# Altium schematic sheet LVDS.SchDoc: Iris
size A3; Organization: Toradex AG; Address1: Altsagenstrasse 5; Address2: Horw; Address3: 6048; Address4: Switzerland; DocumentNumber: 12; Revision: V2.0; SheetNumber: 12; SheetTotal: 16
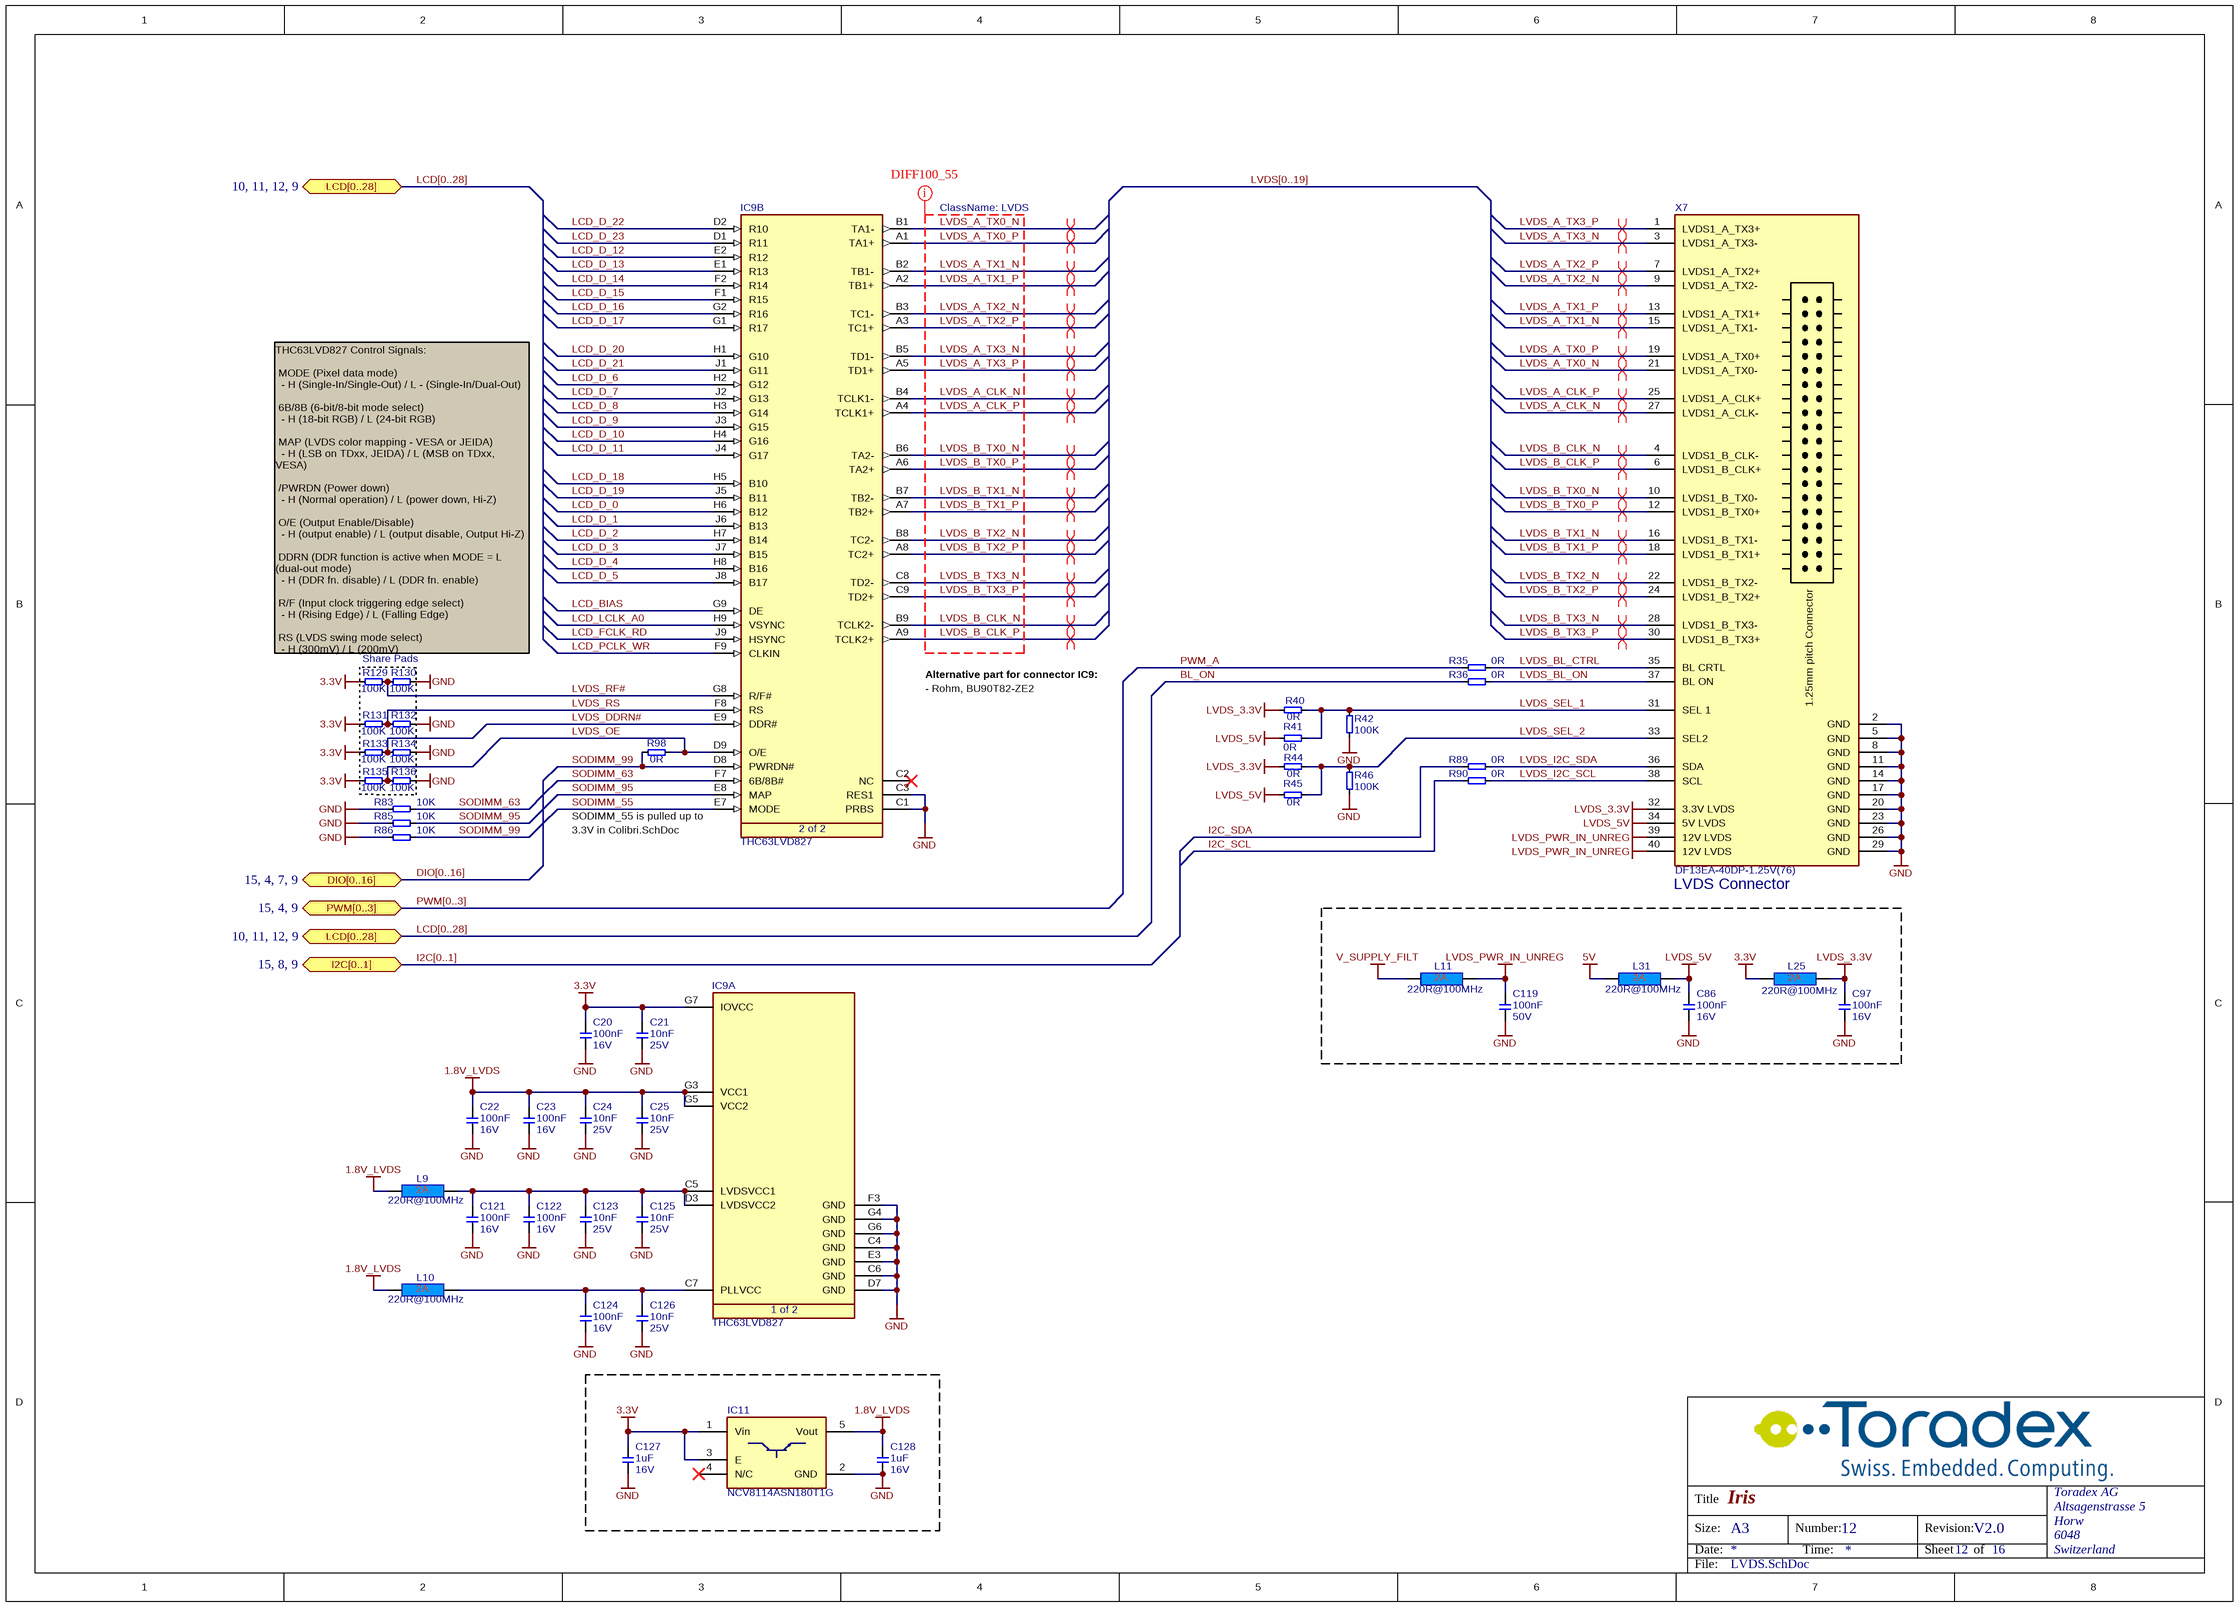
[diagram p0: LVDS.SchDoc]

## Parts
C20  Rating: 16V  [CAPC1005X60N]  (hidden comment: 100nF)
C21  Rating: 25V  [CAPC1005X60N]  (hidden comment: 10nF)
C22  Rating: 16V  [CAPC1005X60N]  (hidden comment: 100nF)
C23  Rating: 16V  [CAPC1005X60N]  (hidden comment: 100nF)
C24  Rating: 25V  [CAPC1005X60N]  (hidden comment: 10nF)
C25  Rating: 25V  [CAPC1005X60N]  (hidden comment: 10nF)
C86  Rating: 16V  [CAPC1005X60N]  (hidden comment: 100nF)
C97  Rating: 16V  [CAPC1005X60N]  (hidden comment: 100nF)
C119  Rating: 50V  [T_CAPC0603X33N]  (hidden comment: 100nF)
C121  Rating: 16V  [CAPC1005X60N]  (hidden comment: 100nF)
C122  Rating: 16V  [CAPC1005X60N]  (hidden comment: 100nF)
C123  Rating: 25V  [CAPC1005X60N]  (hidden comment: 10nF)
C124  Rating: 16V  [CAPC1005X60N]  (hidden comment: 100nF)
C125  Rating: 25V  [CAPC1005X60N]  (hidden comment: 10nF)
C126  Rating: 25V  [CAPC1005X60N]  (hidden comment: 10nF)
C127  Rating: 16V  [T_CAPC0603X33N]  (hidden comment: 1uF)
C128  Rating: 16V  [T_CAPC0603X33N]  (hidden comment: 1uF)
IC9  THC63LVD827  [BGA72C65P9X9_700X700X120]  (parts A,B of 2)
IC11  NCV8114ASN180T1G  [SOT95P279X142-5N]
L9  220R@100MHz  [INDC1608X95N]
L10  220R@100MHz  [INDC1608X95N]
L11  220R@100MHz  [INDC1608X95N]
L25  220R@100MHz  [INDC1608X95N]
L31  220R@100MHz  [INDC1608X95N]
R35  0R  [T_RESC0603X30N]
R36  0R  [T_RESC0603X30N]
R40  0R  [T_RESC0603X30N]
R41  0R  [T_RESC0603X30N]
R42  100K  [T_RESC0603X30N]
R44  0R  [T_RESC0603X30N]
R45  0R  [T_RESC0603X30N]
R46  100K  [T_RESC0603X30N]
R83  10K  [T_RESC0603X30N]
R85  10K  [T_RESC0603X30N]
R86  10K  [T_RESC0603X30N]
R89  0R  [T_RESC0603X30N]
R90  0R  [T_RESC0603X30N]
R98  0R  [T_RESC0603X30N]
R129  100K  [T_RESC0603X30N]
R130  100K  [T_RESC0603X30N]
R131  100K  [T_RESC0603X30N]
R132  100K  [T_RESC0603X30N]
R133  100K  [T_RESC0603X30N]
R134  100K  [T_RESC0603X30N]
R135  100K  [T_RESC0603X30N]
R136  100K  [T_RESC0603X30N]
X7  DF13EA-40DP-1.25V(76)  [T_HIROSE_DF13A-40DP-1.25V(55)]

## Blocks framed on the sheet
Share Pads: R129-R136
LVDS Connector: C86 C97 C119 L11 L25 L31

## Ports
DIO[0..16] (bidir, see 15, 4, 7, 9), I2C[0..1] (bidir, see 15, 8, 9), LCD[0..28] (bidir, see 10, 11, 12, 9), PWM[0..3] (bidir, see 15, 4, 9)

## Nets
1.8V_LVDS: C22.2 C23.2 C24.2 C25.2 C128.2 IC9.G3(VCC1) IC9.G5(VCC2) IC11.5(Vout) L9.1 L10.1
3.3V: C20.2 C21.2 C127.2 IC9.G7(IOVCC) IC11.1(Vin) IC11.3(E) L25.1 R129.1 R131.1 R133.1 R135.1
5V: L31.1
GND: C20.1 C21.1 C22.1 C23.1 C24.1 C25.1 C86.1 C97.1 C119.1 C121.1 C122.1 C123.1 C124.1 C125.1 C126.1 C127.1 C128.1 IC9.C1(PRBS) IC9.C3(RES1) IC9.C4(GND) IC9.C6(GND) IC9.D7(GND) IC9.E3(GND) IC9.F3(GND) IC9.G4(GND) IC9.G6(GND) IC11.2(GND) R42.2 R46.2 R83.2 R85.2 R86.2 R130.2 R132.2 R134.2 R136.2 X7.2(GND) X7.5(GND) X7.8(GND) X7.11(GND) X7.14(GND) X7.17(GND) X7.20(GND) X7.23(GND) X7.26(GND) X7.29(GND)
LVDS_3.3V: C97.2 L25.2 R40.2 R44.1 X7.32(3.3V_LVDS)
LVDS_5V: C86.2 L31.2 R41.1 R45.2 X7.34(5V_LVDS)
LVDS_PWR_IN_UNREG: C119.2 L11.2 X7.39(12V_LVDS) X7.40(12V_LVDS)
V_SUPPLY_FILT: L11.1
BL_ON: R36.2
I2C_SCL: R90.1
I2C_SDA: R89.1
LCD_BIAS: IC9.G9(DE)
LCD_D_0: IC9.H6(B12)
LCD_D_1: IC9.J6(B13)
LCD_D_2: IC9.H7(B14)
LCD_D_3: IC9.J7(B15)
LCD_D_4: IC9.H8(B16)
LCD_D_5: IC9.J8(B17)
LCD_D_6: IC9.H2(G12)
LCD_D_7: IC9.J2(G13)
LCD_D_8: IC9.H3(G14)
LCD_D_9: IC9.J3(G15)
LCD_D_10: IC9.H4(G16)
LCD_D_11: IC9.J4(G17)
LCD_D_12: IC9.E2(R12)
LCD_D_13: IC9.E1(R13)
LCD_D_14: IC9.F2(R14)
LCD_D_15: IC9.F1(R15)
LCD_D_16: IC9.G2(R16)
LCD_D_17: IC9.G1(R17)
LCD_D_18: IC9.H5(B10)
LCD_D_19: IC9.J5(B11)
LCD_D_20: IC9.H1(G10)
LCD_D_21: IC9.J1(G11)
LCD_D_22: IC9.D2(R10)
LCD_D_23: IC9.D1(R11)
LCD_FCLK_RD: IC9.J9(HSYNC)
LCD_LCLK_A0: IC9.H9(VSYNC)
LCD_PCLK_WR: IC9.F9(CLKIN)
LVDS_A_CLK_N: IC9.B4(TCLK1-) X7.27(LVDS1_A_CLK-)
LVDS_A_CLK_P: IC9.A4(TCLK1+) X7.25(LVDS1_A_CLK+)
LVDS_A_TX0_N: IC9.B1(TA1-) X7.21(LVDS1_A_TX0-)
LVDS_A_TX0_P: IC9.A1(TA1+) X7.19(LVDS1_A_TX0+)
LVDS_A_TX1_N: IC9.B2(TB1-) X7.15(LVDS1_A_TX1-)
LVDS_A_TX1_P: IC9.A2(TB1+) X7.13(LVDS1_A_TX1+)
LVDS_A_TX2_N: IC9.B3(TC1-) X7.9(LVDS1_A_TX2-)
LVDS_A_TX2_P: IC9.A3(TC1+) X7.7(LVDS1_A_TX2+)
LVDS_A_TX3_N: IC9.B5(TD1-) X7.3(LVDS1_A_TX3-)
LVDS_A_TX3_P: IC9.A5(TD1+) X7.1(LVDS1_A_TX3+)
LVDS_B_CLK_N: IC9.B9(TCLK2-) X7.4(LVDS1_B_CLK-)
LVDS_B_CLK_P: IC9.A9(TCLK2+) X7.6(LVDS1_B_CLK+)
LVDS_B_TX0_N: IC9.B6(TA2-) X7.10(LVDS1_B_TX0-)
LVDS_B_TX0_P: IC9.A6(TA2+) X7.12(LVDS1_B_TX0+)
LVDS_B_TX1_N: IC9.B7(TB2-) X7.16(LVDS1_B_TX1-)
LVDS_B_TX1_P: IC9.A7(TB2+) X7.18(LVDS1_B_TX1+)
LVDS_B_TX2_N: IC9.B8(TC2-) X7.22(LVDS1_B_TX2-)
LVDS_B_TX2_P: IC9.A8(TC2+) X7.24(LVDS1_B_TX2+)
LVDS_B_TX3_N: IC9.C8(TD2-) X7.28(LVDS1_B_TX3-)
LVDS_B_TX3_P: IC9.C9(TD2+) X7.30(LVDS1_B_TX3+)
LVDS_BL_CTRL: R35.1 X7.35(BL_CRTL)
LVDS_BL_ON: R36.1 X7.37(BL_ON)
LVDS_DDRN#: IC9.E9(DDR#) R133.2 R134.1
LVDS_I2C_SCL: R90.2 X7.38(SCL)
LVDS_I2C_SDA: R89.2 X7.36(SDA)
LVDS_OE: IC9.D9(O/E) R98.2 R135.2 R136.1
LVDS_RF#: IC9.G8(R/F#) R129.2 R130.1
LVDS_RS: IC9.F8(RS) R131.2 R132.1
LVDS_SEL_1: R40.1 R41.2 R42.1 X7.31(SEL_1)
LVDS_SEL_2: R44.2 R45.1 R46.1 X7.33(SEL2)
PWM_A: R35.2
SODIMM_55: IC9.E7(MODE)
SODIMM_63: IC9.F7(6B/8B#) R83.1
SODIMM_95: IC9.E8(MAP) R85.1
SODIMM_99: IC9.D8(PWRDN#) R86.1 R98.1
NetC121_2: C121.2 C122.2 C123.2 C125.2 IC9.C5(LVDSVCC1) IC9.D3(LVDSVCC2) L9.2
NetC124_2: C124.2 C126.2 IC9.C7(PLLVCC) L10.2

Not connected (* = marked no-connect by the designer): IC9 C2(NC)*; IC11 4(N/C)*

## Buses and harness runs
bus DIO[0..16] = port DIO[0..16]
bus I2C[0..1] = port I2C[0..1]
bus LCD[0..28] = port LCD[0..28]
bus LVDS[0..19]
bus PWM[0..3] = port PWM[0..3]

## Layout directives
differential pair: LVDS_A_CLK_N, LVDS_A_CLK_P, LVDS_A_TX0_N, LVDS_A_TX0_P, LVDS_A_TX1_N, LVDS_A_TX1_P, LVDS_A_TX2_N, LVDS_A_TX2_P, LVDS_A_TX3_N, LVDS_A_TX3_P, LVDS_B_CLK_N, LVDS_B_CLK_P, LVDS_B_TX0_N, LVDS_B_TX0_P, LVDS_B_TX1_N, LVDS_B_TX1_P, LVDS_B_TX2_N, LVDS_B_TX2_P, LVDS_B_TX3_N, LVDS_B_TX3_P
net class LVDS: LVDS_A_CLK_N, LVDS_A_CLK_P, LVDS_A_TX0_N, LVDS_A_TX0_P, LVDS_A_TX1_N, LVDS_A_TX1_P, LVDS_A_TX2_N, LVDS_A_TX2_P, LVDS_A_TX3_N, LVDS_A_TX3_P, LVDS_B_CLK_N, LVDS_B_CLK_P, LVDS_B_TX0_N, LVDS_B_TX0_P, LVDS_B_TX1_N, LVDS_B_TX1_P, LVDS_B_TX2_N, LVDS_B_TX2_P, LVDS_B_TX3_N, LVDS_B_TX3_P

## Notes on the sheet
- THC63LVD827 Control Signals:
  MODE (Pixel data mode)
  - H (Single-In/Single-Out) / L - (Single-In/Dual-Out)
  6B/8B (6-bit/8-bit mode select)
  - H (18-bit RGB) / L (24-bit RGB)
  MAP (LVDS color mapping - VESA or JEIDA)
  - H (LSB on TDxx, JEIDA) / L (MSB on TDxx, VESA)
  /PWRDN (Power down)
  - H (Normal operation) / L (power down, Hi-Z)
  O/E (Output Enable/Disable)
  - H (output enable) / L (output disable, Output Hi-Z)
  DDRN (DDR function is active when MODE = L (dual-out mode)
  - H (DDR fn. disable) / L (DDR fn. enable)
  R/F (Input clock triggering edge select)
  - H (Rising Edge) / L (Falling Edge)
  RS (LVDS swing mode select)
  - H (300mV) / L (200mV)
- (near IC9) Alternative part for connector IC9:
- (near IC9) - Rohm, BU90T82-ZE2
- SODIMM_55 is pulled up to
- 3.3V in Colibri.SchDoc
- Title
- Size:
- Date:
- A3
- Number:
- Time:
- Revision:
- Sheet
- of
- File:
- (in symbol CON-Hirose-DF13EA-40DP-1.25V(76)) 1.25mm pitch Connector
- (in symbol IC-THine-THC63LVD827, part A) 1 of 2
- (in symbol IC-THine-THC63LVD827, part B) 2 of 2

## Library data of the parts
C20 C22 C23 C86 C97 C121 C122 C124 = C-X7R-100nF-16V-10%-0402: Capacitor Ceramic X7R 100nF 16V 10% 0402; Tolerance: 10%; Type: X7R; Value: 100nF
C21 C24 C25 C123 C125 C126 = C-X7R-10nF-25V-10%-0402: Capacitor Ceramic X7R 10nF 25V 10% 0402; Tolerance: 10%; Type: X7R; Value: 10nF
C119 = C-X7R-100nF-50V-10%-0603: Capacitor Ceramic X7R 100nF 50V 10% 0603; Tolerance: 10%; Type: X7R; Value: 100nF
C127 C128 = C-X5R-1uF-16V-10%-0603: Capacitor Ceramic X5R 1uF 16V 10% 0603; Tolerance: 10%; Type: X5R; Value: 1uF
IC9 = IC-THine-THC63LVD827: LVDS Transmitter; Manufacturer Name: Thine; Manufacturer Part No.: THC63LVD827
IC11 = IC-OnSemi-NCV8114ASN180T1G: LDO regulator, Vout = 1.8V, Imax = 300mA; Manufacturer Name: ON Semiconductor; Manufacturer Part No.: NCV8114ASN180T1G
L9-L11 L25 L31 = L-220R@100MHz-2A-25%-0603: 220R@100MHz 2A EMI FILTER; Tolerance: 25%; Rating: 2A; Value: 220R@100MHz
R35 R36 R40 R41 R44 R45 R89 R90 R98 = R-0R-63mW-5%-0603: Resistor 0 ohm 63mW 5% 0603; Tolerance: 5%; Value: 0R; Rating: 63mW; Size: 0603 (In)
R42 R46 R129-R136 = R-100KR-63mW-5%-0603: Resistor 100 Kohm 63mW 5% 0603; Value: 100KR; Rating: 63mW; Tolerance: 5%
R83 R85 R86 = R-10KR-63mW-5%-0603: Resistor 10 Kohm 63mW 5% 0603; Value: 10KR; Rating: 63mW; Tolerance: 5%
X7 = CON-Hirose-DF13EA-40DP-1.25V(76): LVDS Connector, 2x20 pin, 1.25mm pitch, SMD; Manufacturer Name: Hirose; No. of ways: 2x20; Pitch: 1.25mm; Manufacturer Part No.: DF13EA-40DP-1.25V(76)